# EAGLE design MPU-9250v2 (EAGLE 7.4.0)
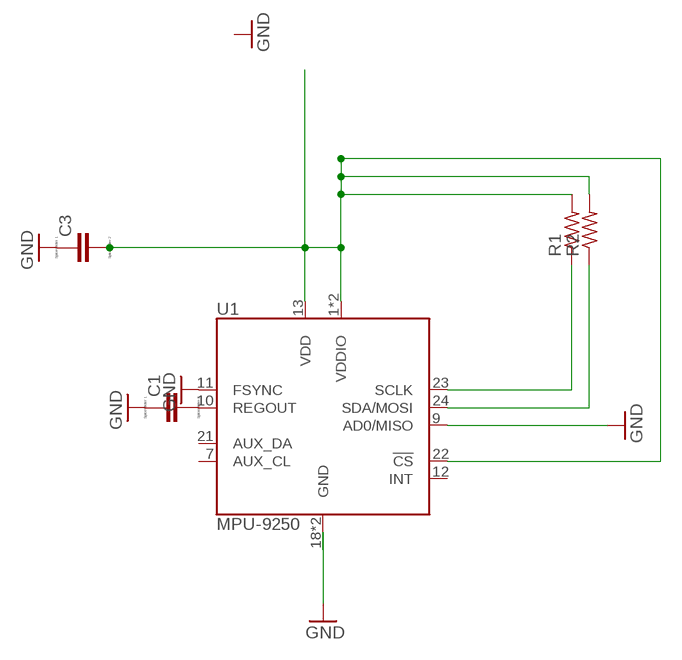
[diagram p0: schematic, sheet 1]

## Parts
C1  CC0603  [C0603]
C3  CC0603  [C0603]
R1  R-US_R0603  [R0603]
R2  R-US_R0603  [R0603]
U1  MPU-9250  [QFN-24/3MM]

## Nets
GND: C1.1 C3.1 U1.9(AD0/MISO) U1.11(FSYNC) U1.18(GND) U1.20(GND)
N$1: R2.1 U1.24(SDA/MOSI)
N$2: R1.1 U1.23(SCLK)
N$4: C3.2 R1.2 R2.2 U1.1(VDDIO) U1.8(VDDIO) U1.13(VDD) U1.22(!CS)
N$8: C1.2 U1.10(REGOUT)
Unconnected: U1.7(AUX_CL) U1.12(INT) U1.21(AUX_DA)

## Library data of the parts
C1 C3 = eagle-ltspice:C: CAPACITOR, European symbol; SPICEMODEL: NONE; SPICEPREFIX: C
R1 R2 = resistor:R-US_: RESISTOR, American symbol
U1 = MPU-9250:MPU-9250: GYRO/ACCEL/COMPASS/9-AXIS

## Net classes
0 default: width 0.051 mm, drill 0.127 mm, clearance 0.076 mm

## Board
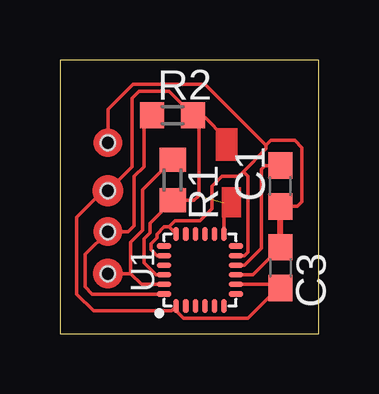
[diagram p1: board, top side]

Size 10.8 x 11.4 mm. Coordinates in mm from the lower left corner, seen from the top.
Outline: 0,0 10.8,0 10.8,11.4 0,11.4 0,0
Copper layers (1*16): Top 0.035mm / dielectric 1.5mm / Bottom 0.035mm
Design rules "default": minimum track width 10mil, minimum drill 24mil, track to track 8mil, track to pad 8mil, pad to pad 8mil, via to via 8mil, smd to smd 8mil, copper to edge 40mil, drill to drill 8mil, minimum pad ring 10mil, minimum via ring 8mil, stop-mask expansion 4mil, vias tented up to drill 0mil, thermal gap 10mil
Holes 0.6 mm at 2,2.5 2,4.25 2,5.95 2,7.95

### Footprints (pad centres in the part's own frame; a part is rotated, then mirrored left to right if it is on the bottom)
C0603 = smd 1.1 x 1: 1 -0.85,0; 2 0.85,0
R0603 = smd 1 x 1.1: 1 -0.85,0; 2 0.85,0
QFN-24/3MM = smd 0.6 x 0.23: 1 -1.5,1; 2 -1.5,0.6; 3 -1.5,0.2; 4 -1.5,-0.2; 5 -1.5,-0.6; 6 -1.5,-1; 13 1.5,-1; 14 1.5,-0.6; 15 1.5,-0.2; 16 1.5,0.2; 17 1.5,0.6; 18 1.5,1 | smd 0.23 x 0.6: 7 -1,-1.5; 8 -0.6,-1.5; 9 -0.2,-1.5; 10 0.2,-1.5; 11 0.6,-1.5; 12 1,-1.5; 19 1,1.5; 20 0.6,1.5; 21 0.2,1.5; 22 -0.2,1.5; 23 -0.6,1.5; 24 -1,1.5

### Placement (x,y rotation side)
C1  9.2,6.15 90 top
C3  9.2,2.75 270 top
R1  4.7,6.4 270 top
R2  4.7,9.1 0 top
U1  5.85,2.65 90 top

### Tracks (layer width: path | path; a pad name or v marks a point on that pad's centre or on a via)
GND
  Top 0.15: U1.20 4.05,3.25 3.8,3.5 3.8,3.75 4.05,4 4.05,4.15 4.35,4.45 4.55,4.45 | 4.55,4.45 4.8,4.7 5.85,4.7 6.35,5.2 6.35,6.15 6.75,6.55 7.45,6.55 7.65,6.75 | U1.18 4.55,4.45 | 7.65,6.75 8.6,7.7 8.6,7.85 | 8.6,7.85 6.05,10.4 3.05,10.4 2,9.35 2,7.95 | U1.11 7.7,3.25 7.85,3.4 7.85,6.55 7.65,6.75 | U1.9 8.05,2.45 C3.1 | C1.1 9.9,5.3 10.1,5.5 10.1,7.75 9.8,8.05 8.8,8.05 8.6,7.85
  Top 0.254: C3.1 C1.1
N$1
  Top 0.15: U1.24 1.35,1.65 1.05,1.95 1.05,3.3 2,4.25 2.85,4.25 3.1,4.5 3.1,6.55 3.5,6.95 3.5,8.75 R2.1
N$2
  Top 0.15: U1.23 3.4,2.05 2.95,2.5 | 2.95,2.5 2.1,2.5 | 2.95,2.5 2.95,3.8 3.45,4.3 3.45,6 R1.1
N$3
  Top 0.15: 5.75,9.05 6,9.05 6.9,8.15
N$4  (1 unrouted)
  Top 0.15: 8.85,1.55 8.85,2.05 U1.8 9.25,2.05 7.85,0.65 5.15,0.65 4.85,0.95 U1.1 4.65,0.95 1.4,0.95 0.7,1.65 0.7,4.85 1.8,5.95 2,5.95 3,6.95 3,9.8 3.3,10.1 4.55,10.1 R2.2 | U1.22 4,2.45 3.5,2.95 3.5,3.95 3.75,4.2 3.75,4.6 R1.2 5.6,5.55 5.8,5.75 5.8,8.85 | U1.13 6.85,5.45 7.1,5.7 7.1,5.75
  Top 0.254: R2.2 5.55,9.45 | 9.05,2.05 C3.2 8.85,1.55 | R2.2 5.8,8.85 5.8,9.1 | 5.55,9.25 R2.2
N$8
  Top 0.15: U1.10 7.7,2.85 8.4,3.55 8.4,6.85 8.55,7 C1.2
(copper drawn outside any net)
  shapes: Top area x3, Top circle x4